# EAGLE schematic eletromiografia_PCB (EAGLE 8.3.2)
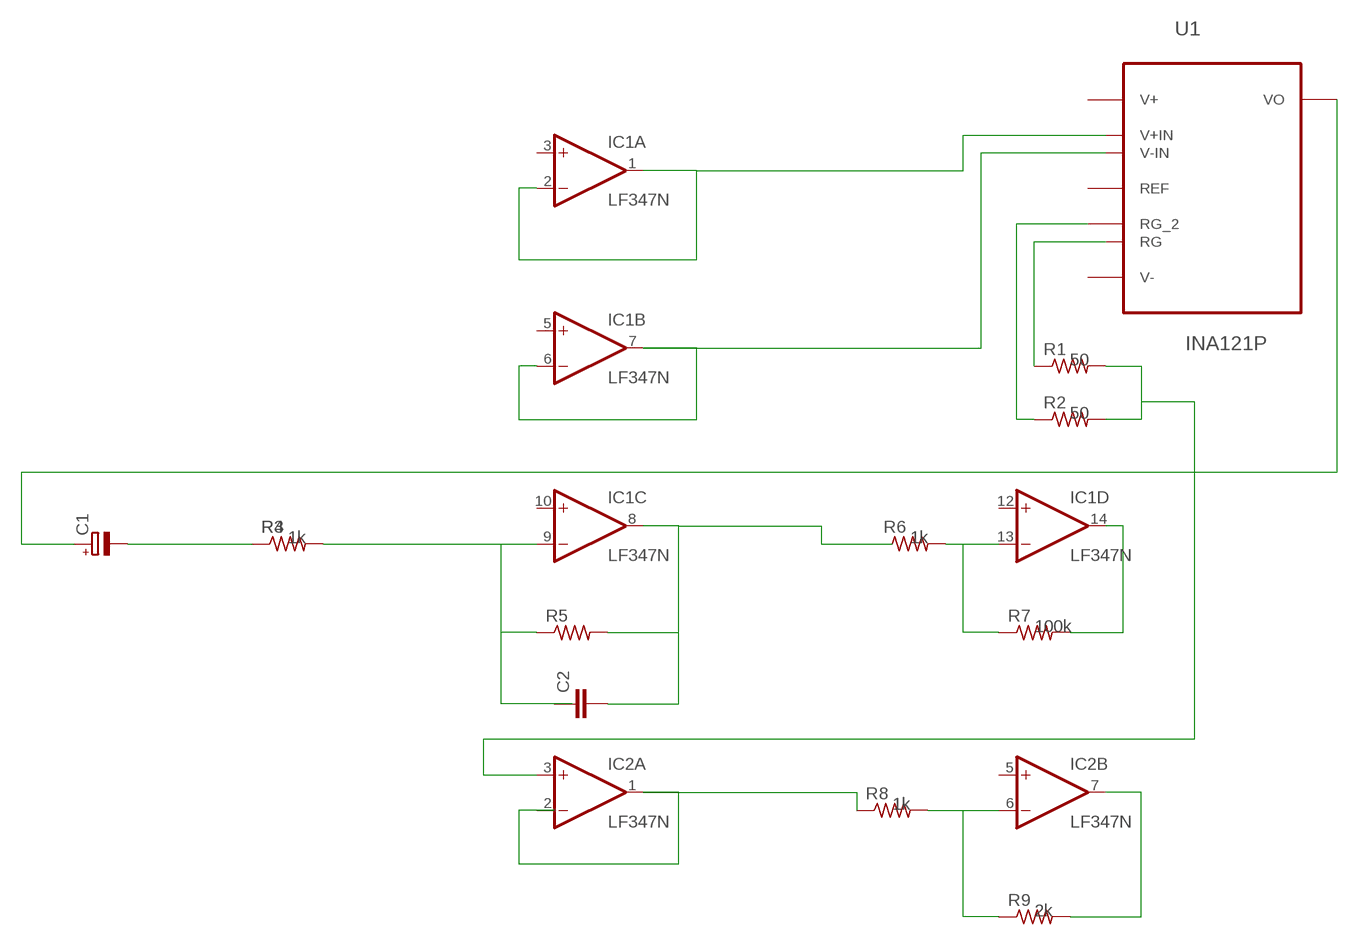
[diagram p0: schematic, sheet 1]

## Parts
C1  CPOL-EUE5-13  [E5-13]
C2  C-EU050-030X075  [C050-030X075]
IC1  LF347N  [DIL14]
IC2  LF347N  [DIL14]
R1  R-US_0207/10  [0207/10]
R2  R-US_0207/10  [0207/10]
R3  R-US_0207/10  [0207/10]
R4  R-US_0207/10  [0207/10]
R5  R-US_0207/10  [0207/10]
R6  R-US_0207/10  [0207/10]
R7  R-US_0207/10  [0207/10]
R8  R-US_0207/10  [0207/10]
R9  R-US_0207/10  [0207/10]
U1  INA121P  [DIP254P762X508-8]

## Nets
N$1: IC1.1(A:OUT) IC1.2(A:-IN)
N$2: IC1.6(B:-IN) IC1.7(B:OUT)
N$3: IC1.9(C:-IN) R3.2 R4.2 R5.1
N$4: C1.- R3.1 R4.1
N$5: R1.1
N$6: IC2.3(A:+IN) R1.2 R2.2
N$7: R2.1 U1.1(RG_2)
N$8: C1.+ U1.6(VO)
N$9: C2.2 IC1.8(C:OUT) R5.2
N$10: IC1.13(D:-IN) R6.2 R7.1
N$11: IC1.14(D:OUT) R7.2
N$12: IC2.1(A:OUT) R8.1
N$13: IC2.6(B:-IN) R8.2 R9.1
N$14: IC2.7(B:OUT) R9.2
Unconnected: C2.1 IC1.3(A:+IN) IC1.5(B:+IN) IC1.10(C:+IN) IC1.12(D:+IN) IC2.2(A:-IN) IC2.5(B:+IN) IC2.8(C:OUT) IC2.9(C:-IN) IC2.10(C:+IN) IC2.12(D:+IN) IC2.13(D:-IN) IC2.14(D:OUT) R6.1 U1.2(V-IN) U1.3(V+IN) U1.5(REF) U1.8(RG)

## Power pins joined to a net without a drawn wire
V+: IC1.4(P:V+) IC2.4(P:V+) U1.7(V+)
V-: IC1.11(P:V-) IC2.11(P:V-) U1.4(V-)

## Library data of the parts
C1 = resistor:CPOL-EU: POLARIZED CAPACITOR, European symbol
C2 = resistor:C-EU: CAPACITOR, European symbol
IC1 IC2 = linear:LF347: OP AMP
R1 = resistor:R-US_: RESISTOR, American symbol; RG1: 50
R2 = resistor:R-US_: RESISTOR, American symbol; RG2: 50
R3 = resistor:R-US_: RESISTOR, American symbol
R4 = resistor:R-US_: RESISTOR, American symbol; RC1: 1k
R5 = resistor:R-US_: RESISTOR, American symbol; RC2: 10k
R6 = resistor:R-US_: RESISTOR, American symbol; R13: 1k
R7 = resistor:R-US_: RESISTOR, American symbol; R14: 100k
R8 = resistor:R-US_: RESISTOR, American symbol; R3: 1k
R9 = resistor:R-US_: RESISTOR, American symbol; R4: 2k
U1 = INA121P:INA121P: INSTRUMENTATION AMPLIFIER; MPN: INA121P; OC_FARNELL: 1651851; OC_NEWARK: 80K5898; PACKAGE: PDIP; SUPPLIER: Texas Instruments